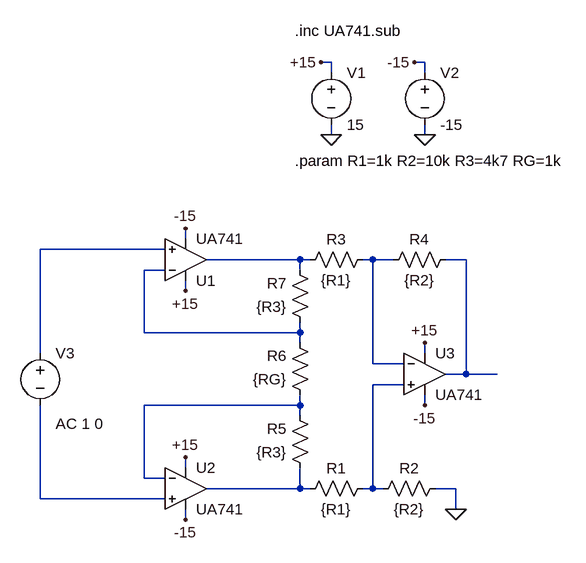
[diagram p0: schematic Draft1.asc]
Draft1.asc, the LTspice schematic file:
Version 4
SHEET 1 880 680
WIRE 384 -144 368 -144
WIRE 528 -144 512 -144
WIRE 384 -128 384 -144
WIRE 528 -128 528 -144
WIRE 384 -32 384 -48
WIRE 528 -32 528 -48
WIRE 160 128 160 112
WIRE 128 144 -64 144
WIRE 336 160 192 160
WIRE 352 160 336 160
WIRE 448 160 432 160
WIRE 480 160 448 160
WIRE 592 160 560 160
WIRE 128 176 96 176
WIRE 336 176 336 160
WIRE 160 208 160 192
WIRE 96 272 96 176
WIRE 336 272 336 256
WIRE 336 272 96 272
WIRE 336 288 336 272
WIRE -64 304 -64 144
WIRE 528 304 528 288
WIRE 448 320 448 160
WIRE 496 320 448 320
WIRE 592 336 592 160
WIRE 592 336 560 336
WIRE 640 336 592 336
WIRE 496 352 448 352
WIRE 336 384 336 368
WIRE 336 384 96 384
WIRE 528 384 528 368
WIRE 336 400 336 384
WIRE 160 480 160 464
WIRE 96 496 96 384
WIRE 128 496 96 496
WIRE 336 512 336 480
WIRE 336 512 192 512
WIRE 352 512 336 512
WIRE 448 512 448 352
WIRE 448 512 432 512
WIRE 464 512 448 512
WIRE 576 512 544 512
WIRE -64 528 -64 384
WIRE 128 528 -64 528
WIRE 576 544 576 512
WIRE 160 560 160 544
FLAG 528 -32 0
FLAG 384 -32 0
FLAG 368 -144 +15
FLAG 512 -144 -15
FLAG 160 208 +15
FLAG 160 464 +15
FLAG 160 112 -15
FLAG 160 560 -15
FLAG 528 384 -15
FLAG 528 288 +15
FLAG 576 544 0
SYMBOL Opamps\\opamp2 160 224 M180
SYMATTR InstName U1
SYMATTR Value UA741
SYMBOL Opamps\\opamp2 160 448 R0
SYMATTR InstName U2
SYMATTR Value UA741
SYMBOL Opamps\\opamp2 528 272 R0
SYMATTR InstName U3
SYMATTR Value UA741
SYMBOL voltage 384 -144 R0
WINDOW 123 0 0 Left 0
WINDOW 39 0 0 Left 0
SYMATTR InstName V1
SYMATTR Value 15
SYMBOL voltage 528 -144 R0
WINDOW 123 0 0 Left 0
WINDOW 39 0 0 Left 0
SYMATTR InstName V2
SYMATTR Value -15
SYMBOL res 448 496 R90
WINDOW 0 0 56 VBottom 2
WINDOW 3 32 56 VTop 2
SYMATTR InstName R1
SYMATTR Value {R1}
SYMBOL res 560 496 R90
WINDOW 0 0 56 VBottom 2
WINDOW 3 32 56 VTop 2
SYMATTR InstName R2
SYMATTR Value {R2}
SYMBOL res 448 144 R90
WINDOW 0 0 56 VBottom 2
WINDOW 3 32 56 VTop 2
SYMATTR InstName R3
SYMATTR Value {R1}
SYMBOL res 576 144 R90
WINDOW 0 0 56 VBottom 2
WINDOW 3 32 56 VTop 2
SYMATTR InstName R4
SYMATTR Value {R2}
SYMBOL res 352 496 R180
WINDOW 0 36 76 Left 2
WINDOW 3 36 40 Left 2
SYMATTR InstName R5
SYMATTR Value {R3}
SYMBOL res 352 384 R180
WINDOW 0 36 76 Left 2
WINDOW 3 36 40 Left 2
SYMATTR InstName R6
SYMATTR Value {RG}
SYMBOL res 352 272 R180
WINDOW 0 36 76 Left 2
WINDOW 3 36 40 Left 2
SYMATTR InstName R7
SYMATTR Value {R3}
SYMBOL voltage -64 288 R0
WINDOW 3 24 152 Left 2
WINDOW 123 24 124 Left 2
WINDOW 39 0 0 Left 0
SYMATTR InstName V3
SYMATTR Value ""
SYMATTR Value2 AC 1 0
TEXT 328 -192 Left 2 !.inc UA741.sub
TEXT 328 8 Left 2 !.param R1=1k R2=10k R3=4k7 RG=1k

The netlist it stands for:
* Draft1.asc
XU1 N001 N005 +15 -15 N002 UA741  ; pins In+ In- V+ V- OUT
XU2 N009 N007 +15 -15 N008 UA741  ; pins In+ In- V+ V- OUT
XU3 N006 N003 +15 -15 N004 UA741  ; pins In+ In- V+ V- OUT
V1 +15 0 15
V2 -15 0 -15
R1 N006 N008 {R1}
R2 0 N006 {R2}
R3 N003 N002 {R1}
R4 N004 N003 {R2}
R5 N008 N007 {R3}
R6 N007 N005 {RG}
R7 N005 N002 {R3}
V3 N001 N009 AC 1 0
.inc UA741.sub
.param R1=1k R2=10k R3=4k7 RG=1k
.backanno
.end